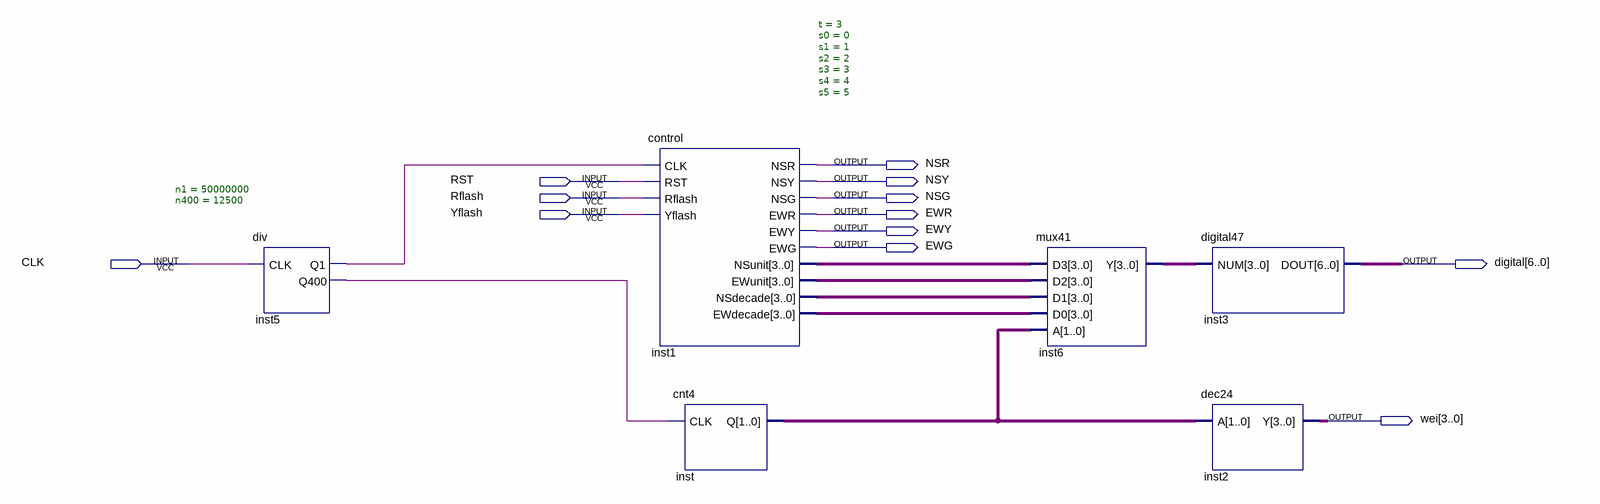
[diagram p0: schematic sheet]
// Quartus schematic fpga.bdf as structural Verilog: 6 symbols, 12 pins
module fpga (
  input  RST,
  input  Rflash,
  input  Yflash,
  input  CLK,
  output NSR,
  output NSY,
  output NSG,
  output EWR,
  output EWY,
  output EWG,
  output [6:0] digital,
  output [3:0] wei
);

  wire inst5_q1, inst5_q400;
  wire [1:0] inst_q;
  wire [3:0] inst1_ewdecade, inst1_ewunit, inst1_nsdecade, inst1_nsunit, inst6_y;

  div #(.n1(50000000), .n400(12500)) inst5 (.CLK(CLK), .Q1(inst5_q1), .Q400(inst5_q400));
  control #(.t(3), .s0(0), .s1(1), .s2(2), .s3(3), .s4(4), .s5(5)) inst1 (
    .CLK(inst5_q1), .RST(RST), .Rflash(Rflash), .Yflash(Yflash), .NSR(NSR), .NSY(NSY), .NSG(NSG), .EWR(EWR),
    .EWY(EWY), .EWG(EWG), .NSunit(inst1_nsunit), .EWunit(inst1_ewunit), .NSdecade(inst1_nsdecade),
    .EWdecade(inst1_ewdecade));
  cnt4 inst (.CLK(inst5_q400), .Q(inst_q));
  mux41 inst6 (.D3(inst1_nsunit), .D2(inst1_ewunit), .D1(inst1_nsdecade), .D0(inst1_ewdecade), .A(inst_q), .Y(inst6_y));
  digital47 inst3 (.NUM(inst6_y), .DOUT(digital));
  dec24 inst2 (.A(inst_q), .Y(wei));
endmodule
